# Altium project Nebulizer_medical.PrjPcb
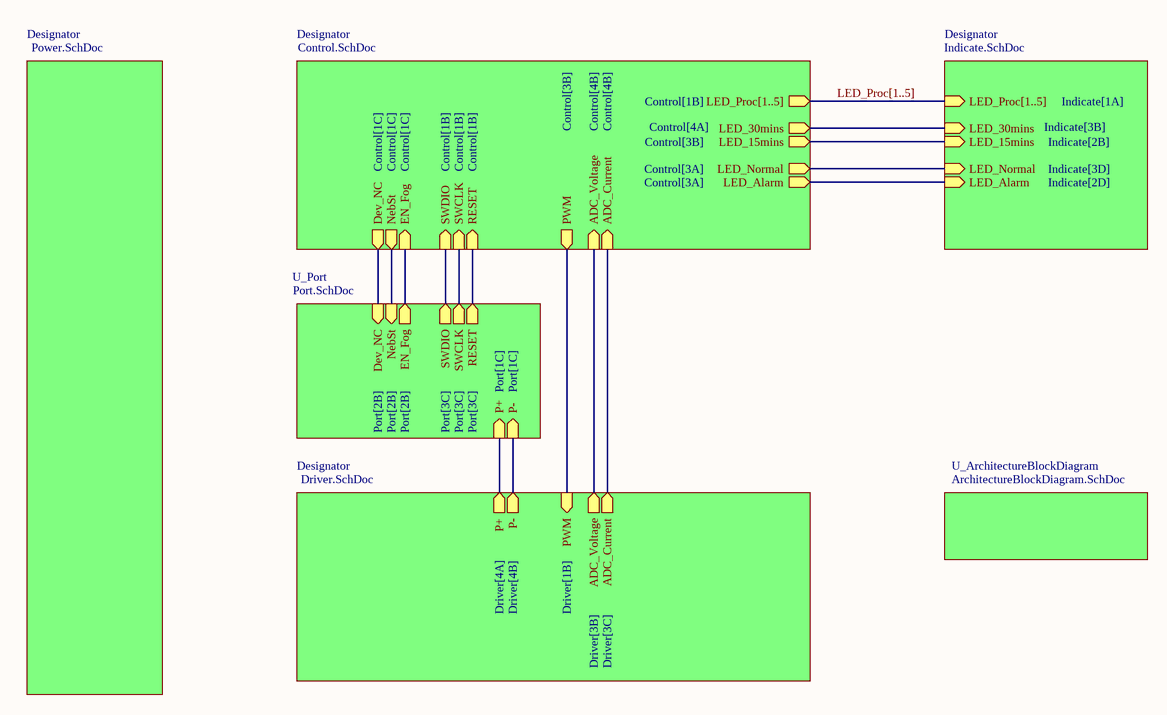
[diagram p0: Top.SchDoc]
7 sheets, 115 parts. Net scope: hierarchical (ports join the sheet entries above them; power ports are global).
Board file: Nebulizer_medical.PcbDoc
Sheets:
  Top.SchDoc
    Designator = Power.SchDoc
    Designator = Control.SchDoc
    Designator = Driver.SchDoc
    Designator = Indicate.SchDoc
    U_ArchitectureBlockDiagram = ArchitectureBlockDiagram.SchDoc
    U_Port = Port.SchDoc

## Sheet Top.SchDoc
size A4; SheetNumber: 1; SheetTotal: 7

### Sub-sheets
Designator = Power.SchDoc: no entries
Designator = Control.SchDoc: LED_30mins (out), LED_Normal (out), LED_15mins (out), PWM (out), ADC_Current (in), ADC_Voltage (in), LED_Alarm (out), Dev_NC (out), NebSt (out), EN_Fog (in), RESET (in), LED_Proc[1..5] (out), SWDIO (in), SWCLK (in)
Designator = Driver.SchDoc: PWM (in), ADC_Current (out), ADC_Voltage (out), P+ (out), P- (out)
Designator = Indicate.SchDoc: LED_Normal (in), LED_30mins (in), LED_15mins (in), LED_Alarm (in), LED_Proc[1..5] (in)
U_ArchitectureBlockDiagram = ArchitectureBlockDiagram.SchDoc: no entries
U_Port = Port.SchDoc: P+ (in), P- (in), Dev_NC (in), NebSt (in), EN_Fog (out), SWCLK (out), SWDIO (out), RESET (out)

### Nets
ADC_Current: sheet Designator/ADC_Current, sheet Designator/ADC_Current
ADC_Voltage: sheet Designator/ADC_Voltage, sheet Designator/ADC_Voltage
Dev_NC: sheet Designator/Dev_NC, sheet U_Port/Dev_NC
EN_Fog: sheet Designator/EN_Fog, sheet U_Port/EN_Fog
NebSt: sheet Designator/NebSt, sheet U_Port/NebSt
PWM: sheet Designator/PWM, sheet Designator/PWM
RESET: sheet Designator/RESET, sheet U_Port/RESET
SWCLK: sheet Designator/SWCLK, sheet U_Port/SWCLK
SWDIO: sheet Designator/SWDIO, sheet U_Port/SWDIO
NetB1_2: sheet Designator/P+, sheet U_Port/P+
NetB2_2: sheet Designator/P-, sheet U_Port/P-
NetLED6_2: sheet Designator/LED_Alarm, sheet Designator/LED_Alarm
NetLED7_2: sheet Designator/LED_Normal, sheet Designator/LED_Normal
NetLED8_2: sheet Designator/LED_15mins, sheet Designator/LED_15mins
NetLED9_2: sheet Designator/LED_30mins, sheet Designator/LED_30mins

### Buses and harness runs
bus LED_Proc[1..5] = sheet Designator/LED_Proc[1..5]

## Sheet Power.SchDoc
size A4; SheetNumber: 2; SheetTotal: 7
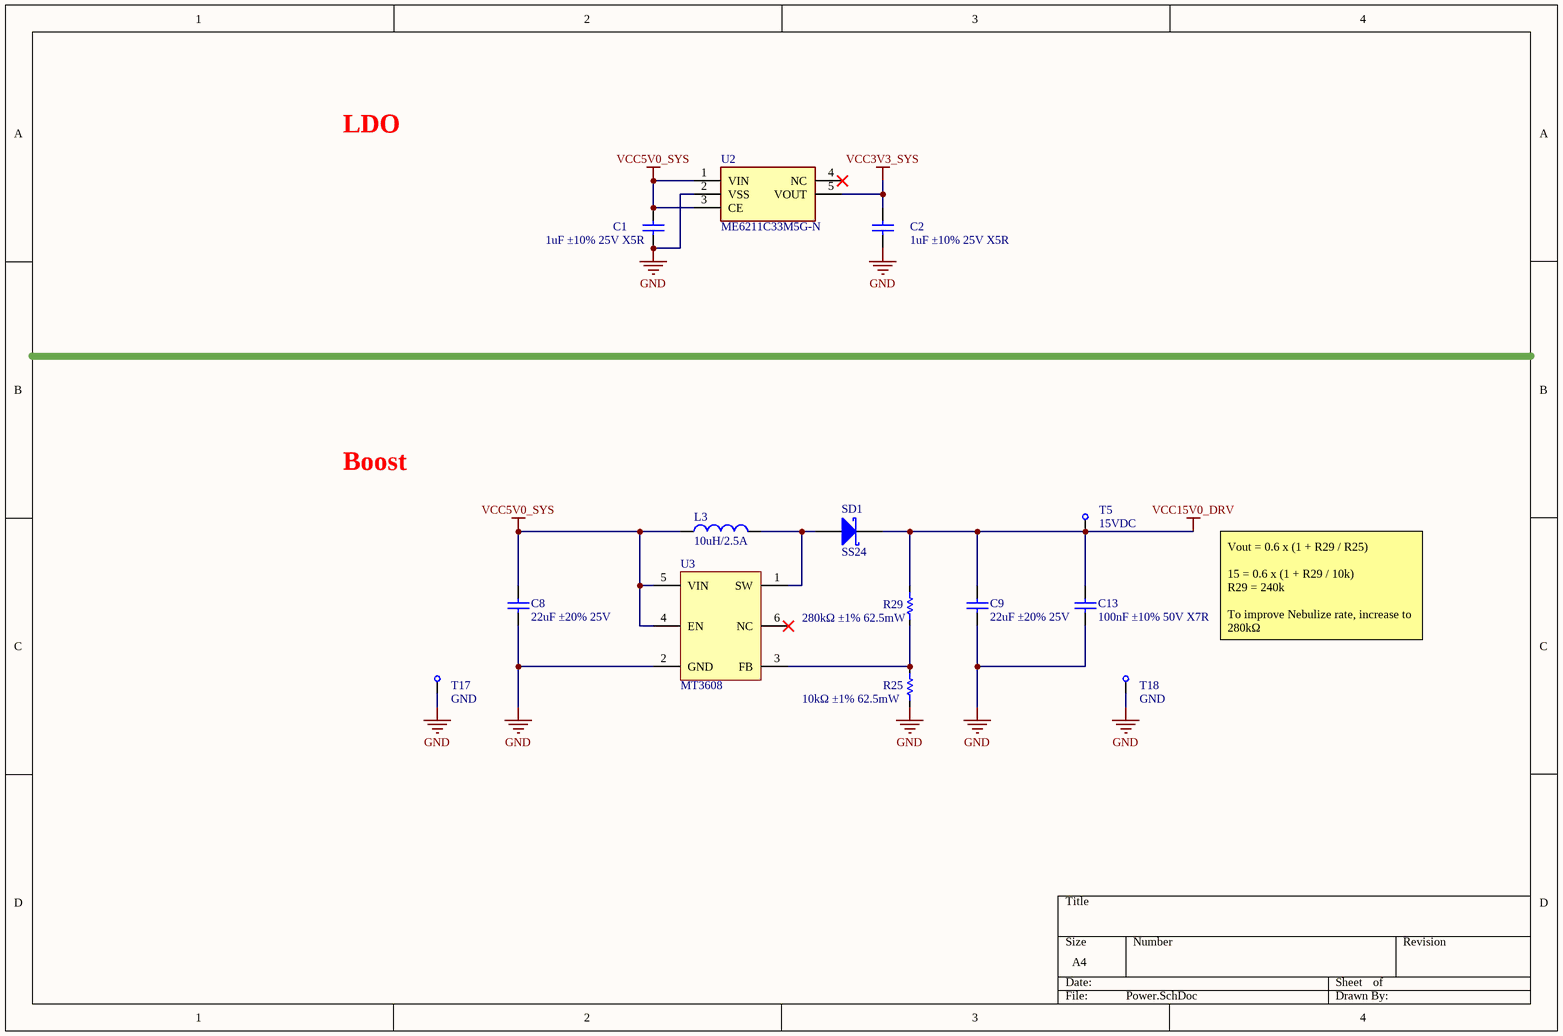
[diagram p1: Power.SchDoc]

### Parts
C1  1uF ±10% 25V X5R  [C0402]
C2  1uF ±10% 25V X5R  [C0402]
C8  22uF ±20% 25V  [C0805]
C9  22uF ±20% 25V  [C0805]
C13  100nF ±10% 50V X7R  [C0402]
L3  10uH/2.5A  [SP0502]
R25  10kΩ ±1% 62.5mW  [R0402]
R29  280kΩ ±1% 62.5mW  [R0402]
SD1  SS24  [SMA-403D]
T5  15VDC  [TP-SIP-1-Small1]
T17  GND  [TP-SIP-1-Small1]
T18  GND  [TP-SIP-1-Small1]
U2  ME6211C33M5G-N  [SOT95P270X145-5N]
U3  MT3608  [SOT95P280X110-6N]

### Nets
GND: C1.1 C2.1 C8.1 C9.1 C13.2 R25.1 T17.1 T18.1 U2.2(VSS) U3.2(GND)
VCC3V3_SYS: C2.2 U2.5(VOUT)
VCC5V0_SYS: C1.2 C8.2 L3.1 U2.1(VIN) U2.3(CE) U3.4(EN) U3.5(VIN)
VCC15V0_DRV: C9.2 C13.1 R29.2 SD1.2(K) T5.1
NetL3_2: L3.2 SD1.1(A) U3.1(SW)
NetR25_2: R25.2 R29.1 U3.3(FB)

Not connected (* = marked no-connect by the designer): U2 4(NC)*; U3 6(NC)*

### Notes on the sheet
- LDO
- Boost
- Vout = 0.6 x (1 + R29 / R25)
  15 = 0.6 x (1 + R29 / 10k)
  R29 = 240k
  To improve Nebulize rate, increase to 280kΩ

### Library data of the parts
C1 C2 = Cap: CL05A475KP5NRNC; Published: 8-Jun-2000; LatestRevisionDate: 17-Jul-2002; LatestRevisionNote: Re-released for DXP Platform.; PackageReference: RAD-0.3; Publisher: Altium Limited; PackageDescription: Radial Cap, Thru-Hole; 2 Leads; 0.3 in Pin Spacing
C8 C9 = C0805: CL21A226MAQNNNE; Published: 8-Jun-2000; LatestRevisionDate: 17-Jul-2002; LatestRevisionNote: Re-released for DXP Platform.; PackageReference: RAD-0.3; Publisher: Altium Limited; PackageDescription: Radial Cap, Thru-Hole; 2 Leads; 0.3 in Pin Spacing
C13 = Cap Semi: CL05B104KB54PNC; Value: 100pF; Published: 8-Jun-2000; LatestRevisionDate: 29-May-2009; LatestRevisionNote: IPC-7351 Footprint Added.; PackageReference: C1206; Publisher: Altium Limited; PackageDescription: Chip Capacitor
L3 = Inductor: SWPA6028S100MT; Code_IEC: 1005; Value: 10uH; Published: 8-Jun-2000; LatestRevisionDate: 29-May-2009; LatestRevisionNote: IPC-7351 Footprint Added.; PackageReference: 0402-A; Publisher: Altium Limited; PackageDescription: Chip Inductor; Code_JEITA: 0402
R25 = R0402: 0402WGF1002TCE; Published: 8-Jun-2000; LatestRevisionDate: 17-Jul-2002; LatestRevisionNote: Re-released for DXP Platform.; PackageReference: AXIAL-0.3; Publisher: Altium Limited; PackageDescription: Axial Device, Thru-Hole; 2 Leads; 0.3 in Pin Spacing
R29 = R0402: 0402WGF2803TCE; Published: 8-Jun-2000; LatestRevisionDate: 17-Jul-2002; LatestRevisionNote: Re-released for DXP Platform.; PackageReference: AXIAL-0.3; Publisher: Altium Limited; PackageDescription: Axial Device, Thru-Hole; 2 Leads; 0.3 in Pin Spacing
SD1 = D Schottky: C50645; Published: 8-Jun-2000; LatestRevisionDate: 17-Jul-2002; LatestRevisionNote: Re-released for DXP Platform.; PackageReference: SMB; Publisher: Altium Limited; PackageDescription: DO-214-AA/SMB; 2 C-Bend Leads; Body 5.3 x 3.6 mm, inc. leads (LxW); Code_JEDEC: DO-214-AA
T5 T17 T18 = TP-SIP-1-Small
U2 = ME6211C33M5G-N: ME6211C33M5G-N / LDO 3.3V; Manufacturer_Name: Microne; Datasheet Link: https://datasheet.lcsc.com/szlcsc/1811131510_MICRONE-Nanjing-Micro-One-Elec-ME6211C33M5G-N_C82942.pdf; Height: 1.45mm; Manufacturer_Part_Number: ME6211C33M5G-N

## Sheet Control.SchDoc
size A3; SheetNumber: 4; SheetTotal: 7
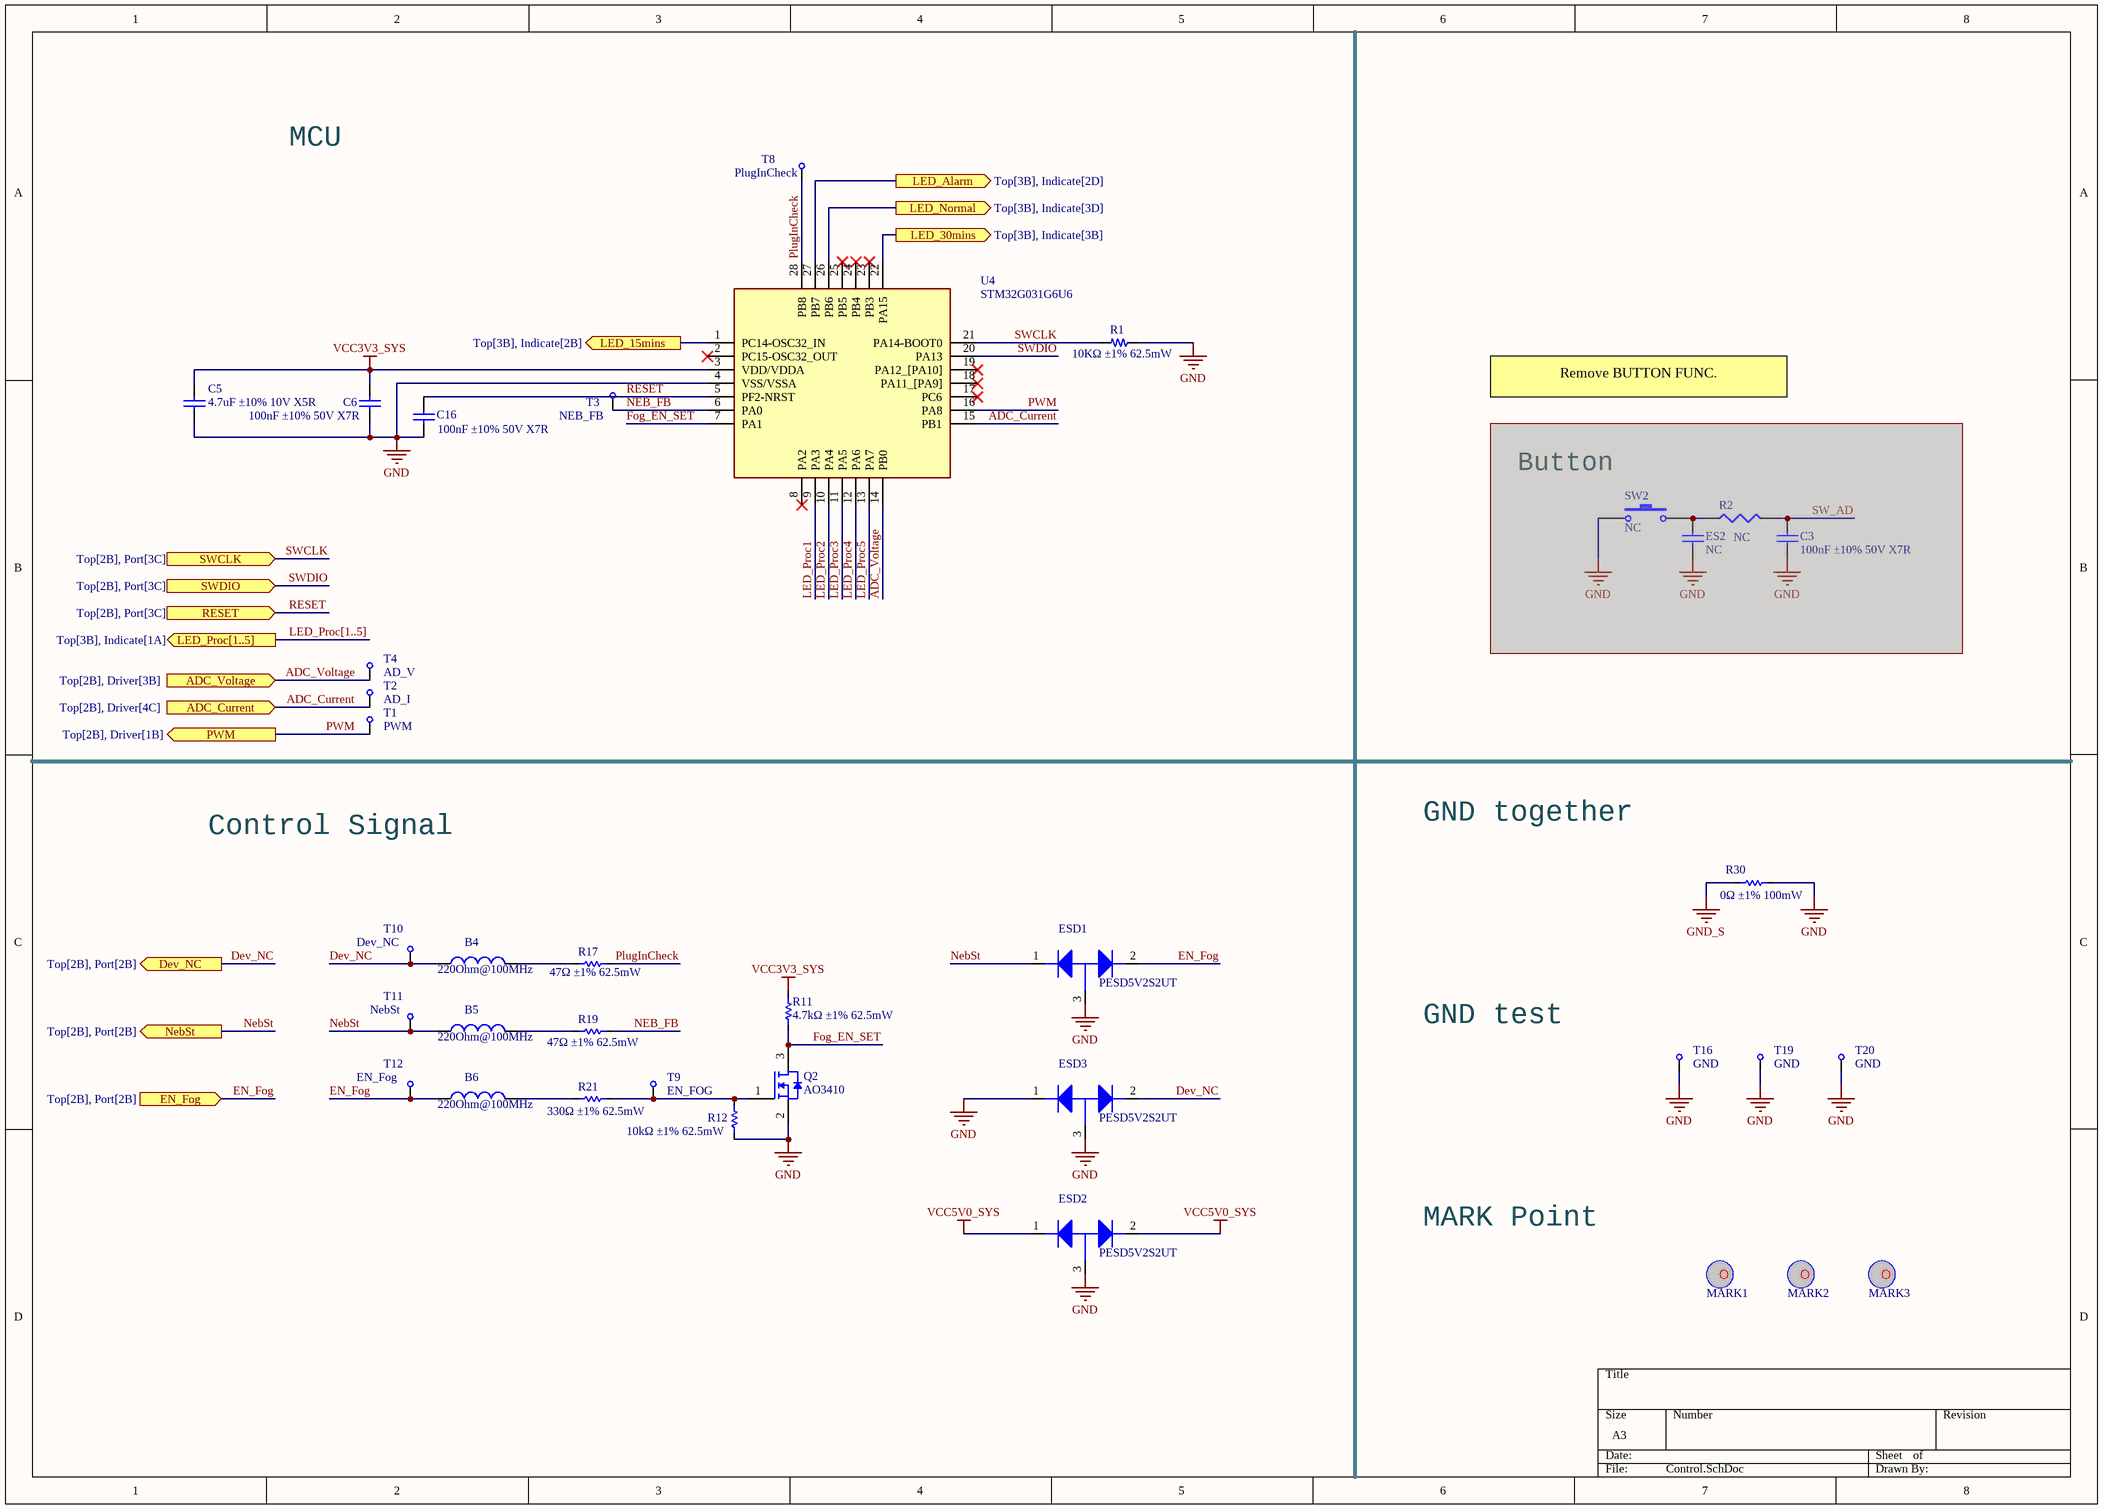
[diagram p2: Control.SchDoc]

### Parts
B4  220Ohm@100MHz  [0402-B]
B5  220Ohm@100MHz  [0402-B]
B6  220Ohm@100MHz  [0402-B]
C3  100nF ±10% 50V X7R  [C0402]  (masked out: inside a compile mask, not in the netlist)
C5  4.7uF ±10% 10V X5R  [C0402]
C6  100nF ±10% 50V X7R  [C0402]
C16  100nF ±10% 50V X7R  [C0402]
ES2  NC  [C0402]  (masked out: inside a compile mask, not in the netlist)
ESD1  PESD5V2S2UT  [SOT23]
ESD2  PESD5V2S2UT  [SOT23]
ESD3  PESD5V2S2UT  [SOT23]
MARK1  MARK_POINT  [MARK_POINT]  (value not drawn)
MARK2  MARK_POINT  [MARK_POINT]  (value not drawn)
MARK3  MARK_POINT  [MARK_POINT]  (value not drawn)
Q2  AO3410  [SOT23-3]
R1  10KΩ ±1% 62.5mW  [R0402]
R2  NC  [R0402]  (masked out: inside a compile mask, not in the netlist)
R11  4.7kΩ ±1% 62.5mW  [R0402]
R12  10kΩ ±1% 62.5mW  [R0402]
R17  47Ω ±1% 62.5mW  [R0402]
R19  47Ω ±1% 62.5mW  [R0402]
R21  330Ω ±1% 62.5mW  [R0402]
R30  0Ω ±1% 100mW  [R0603]
SW2  NC  [HTS-52MB]  (masked out: inside a compile mask, not in the netlist)
T1  PWM  [TP-SIP-1-Small1]
T2  AD_I  [TP-SIP-1-Small1]
T3  NEB_FB  [TP-SIP-1-Small1]
T4  AD_V  [TP-SIP-1-Small1]
T8  PlugInCheck  [TP-SIP-1-Small1]
T9  EN_FOG  [TP-SIP-1-Small1]
T10  Dev_NC  [TP-SIP-1-Small1]
T11  NebSt  [TP-SIP-1-Small1]
T12  EN_Fog  [TP-SIP-1-Small1]
T16  GND  [TP-SIP-1-Small1]
T19  GND  [TP-SIP-1-Small1]
T20  GND  [TP-SIP-1-Small1]
U4  STM32G031G6U6  [QFN50P400X400X60-28N-D]

### Ports
ADC_Current (in, see Top[2B], Driver[4C]), ADC_Voltage (in, see Top[2B], Driver[3B]), Dev_NC (out, see Top[2B], Port[2B]), EN_Fog (in, see Top[2B], Port[2B]), LED_15mins (out, see Top[3B], Indicate[2B]), LED_30mins (out, see Top[3B], Indicate[3B]), LED_Alarm (out, see Top[3B], Indicate[2D]), LED_Normal (out, see Top[3B], Indicate[3D]), LED_Proc[1..5] (out, see Top[3B], Indicate[1A]), NebSt (out, see Top[2B], Port[2B]), PWM (out, see Top[2B], Driver[1B]), RESET (in, see Top[2B], Port[3C]), SWCLK (in, see Top[2B], Port[3C]), SWDIO (in, see Top[2B], Port[3C])

### Nets
GND: C5.1 C6.1 C16.1 ESD1.3(G) ESD2.3(G) ESD3.1(S) ESD3.3(G) Q2.2(S) R1.1 R12.1 R30.2 T16.1 T19.1 T20.1 U4.4(VSS/VSSA)
GND_S: R30.1
VCC3V3_SYS: C5.2 C6.2 R11.2 U4.3(VDD/VDDA)
VCC5V0_SYS: ESD2.1(S) ESD2.2(S)
ADC_Current: T2.1 U4.15(PB1) ; port ADC_Current
ADC_Voltage: T4.1 U4.14(PB0) ; port ADC_Voltage
Dev_NC: B4.1 ESD3.2(S) T10.1 ; port Dev_NC
EN_Fog: B6.1 ESD1.2(S) T12.1 ; port EN_Fog
Fog_EN_SET: Q2.3(D) R11.1 U4.7(PA1)
LED_Proc1: U4.9(PA3)
LED_Proc2: U4.10(PA4)
LED_Proc3: U4.11(PA5)
LED_Proc4: U4.12(PA6)
LED_Proc5: U4.13(PA7)
NEB_FB: R19.2 T3.1 U4.6(PA0)
NebSt: B5.1 ESD1.1(S) T11.1 ; port NebSt
PlugInCheck: R17.2 T8.1 U4.28(PB8)
PWM: T1.1 U4.16(PA8) ; port PWM
RESET: C16.2 U4.5(PF2-NRST) ; port RESET
SWCLK: R1.2 U4.21(PA14-BOOT0) ; port SWCLK
SWDIO: U4.20(PA13) ; port SWDIO
NetB4_2: B4.2 R17.1
NetB5_2: B5.2 R19.1
NetB6_2: B6.2 R21.1
NetLED6_2: U4.27(PB7) ; port LED_Alarm
NetLED7_2: U4.26(PB6) ; port LED_Normal
NetLED8_2: U4.1(PC14-OSC32_IN) ; port LED_15mins
NetLED9_2: U4.22(PA15) ; port LED_30mins
NetQ2_1: Q2.1(G) R12.2 R21.2 T9.1

Not connected (* = marked no-connect by the designer): U4 2(PC15-OSC32_OUT)* 8(PA2)* 17(PC6)* 18(PA11_[PA9])* 19(PA12_[PA10])* 23(PB3)* 24(PB4)* 25(PB5)*

### Buses and harness runs
bus LED_Proc[1..5] = port LED_Proc[1..5]

### Notes on the sheet
- MCU
- Remove BUTTON FUNC.
- (near SW2) Button
- Control Signal
- GND together
- GND test
- MARK Point

### Library data of the parts
B4-B6 = Inductor: BLM15AG221SN1D; Code_IEC: 1005; Value: 10uH; Published: 8-Jun-2000; LatestRevisionDate: 29-May-2009; LatestRevisionNote: IPC-7351 Footprint Added.; PackageReference: 0402-A; Publisher: Altium Limited; PackageDescription: Chip Inductor; Code_JEITA: 0402
C3 ES2 = Cap Semi: Capacitor (Semiconductor SIM Model); Value: 100pF; Published: 8-Jun-2000; LatestRevisionDate: 29-May-2009; LatestRevisionNote: IPC-7351 Footprint Added.; PackageReference: C1206; Publisher: Altium Limited; PackageDescription: Chip Capacitor
C5 = Cap: CL05A475KP5NRNC; Published: 8-Jun-2000; LatestRevisionDate: 17-Jul-2002; LatestRevisionNote: Re-released for DXP Platform.; PackageReference: RAD-0.3; Publisher: Altium Limited; PackageDescription: Radial Cap, Thru-Hole; 2 Leads; 0.3 in Pin Spacing
C6 C16 = Cap: CL05B104KO5NNNC; Published: 8-Jun-2000; LatestRevisionDate: 17-Jul-2002; LatestRevisionNote: Re-released for DXP Platform.; PackageReference: RAD-0.3; Publisher: Altium Limited; PackageDescription: Radial Cap, Thru-Hole; 2 Leads; 0.3 in Pin Spacing
ESD1-ESD3 = ESD
Q2 = AO3410: AOS,AO3410,SOT23-3,-55~+150°C,; 名称: N-MOS AO3410; 制造商: AOS; 详细信息: AOS,AO3410,SOT23-3,-55~+150°C,
R1 = R-0603: 0402WGF1002TCE
R2 = Res3: Resistor; Value: 4.7K; Published: 8-Jun-2000; LatestRevisionDate: 29-May-2009; LatestRevisionNote: IPC-7351 Footprint Added.; PackageReference: J1-0603; Publisher: Altium Limited; PackageDescription: Chip Resistor
R11 = R0402: 0402WGF4701TCE; Published: 8-Jun-2000; LatestRevisionDate: 17-Jul-2002; LatestRevisionNote: Re-released for DXP Platform.; PackageReference: AXIAL-0.3; Publisher: Altium Limited; PackageDescription: Axial Device, Thru-Hole; 2 Leads; 0.3 in Pin Spacing
R12 = R0402: 0402WGF1002TCE; Published: 8-Jun-2000; LatestRevisionDate: 17-Jul-2002; LatestRevisionNote: Re-released for DXP Platform.; PackageReference: AXIAL-0.3; Publisher: Altium Limited; PackageDescription: Axial Device, Thru-Hole; 2 Leads; 0.3 in Pin Spacing
R17 R19 = R0402: RC0402FR-0747RL; Published: 8-Jun-2000; LatestRevisionDate: 17-Jul-2002; LatestRevisionNote: Re-released for DXP Platform.; PackageReference: AXIAL-0.3; Publisher: Altium Limited; PackageDescription: Axial Device, Thru-Hole; 2 Leads; 0.3 in Pin Spacing
R21 = R0402: 0402WGF3300TCE; Published: 8-Jun-2000; LatestRevisionDate: 17-Jul-2002; LatestRevisionNote: Re-released for DXP Platform.; PackageReference: AXIAL-0.3; Publisher: Altium Limited; PackageDescription: Axial Device, Thru-Hole; 2 Leads; 0.3 in Pin Spacing
R30 = R0603: 0603WAF0000T5E; Published: 8-Jun-2000; LatestRevisionDate: 17-Jul-2002; LatestRevisionNote: Re-released for DXP Platform.; PackageReference: AXIAL-0.3; Publisher: Altium Limited; PackageDescription: Axial Device, Thru-Hole; 2 Leads; 0.3 in Pin Spacing
SW2 = SW-PB: Switch; Published: 24-Mar-1999; LatestRevisionDate: 17-Jul-2002; LatestRevisionNote: Re-released for DXP Platform.; PackageReference: SPST-2; Publisher: Altium Limited; PackageDescription: Switch; 2 Leads
T1-T4 T8-T12 T16 T19 T20 = TP-SIP-1-Small
U4 = STM32G031G6U6: Manufacturer_Name: STMicroelectronics; Datasheet Link: https://www.st.com/resource/en/datasheet/stm32g031c6.pdf; Height: 0.6mm; Manufacturer_Part_Number: STM32G031G6U6; Mouser Part Number: 511-STM32G031G6U6; Mouser Price/Stock: https://www.mouser.co.uk/ProductDetail/STMicroelectronics/STM32G031G6U6?qs=uwxL4vQweFPW1MMtF4vVDQ%3D%3D; Arrow Part Number: STM32G031G6U6; Arrow Price/Stock: https://www.arrow.com/en/products/stm32g031g6u6/stmicroelectronics?region=nac

## Sheet Driver.SchDoc
size A4; SheetNumber: 6; SheetTotal: 7
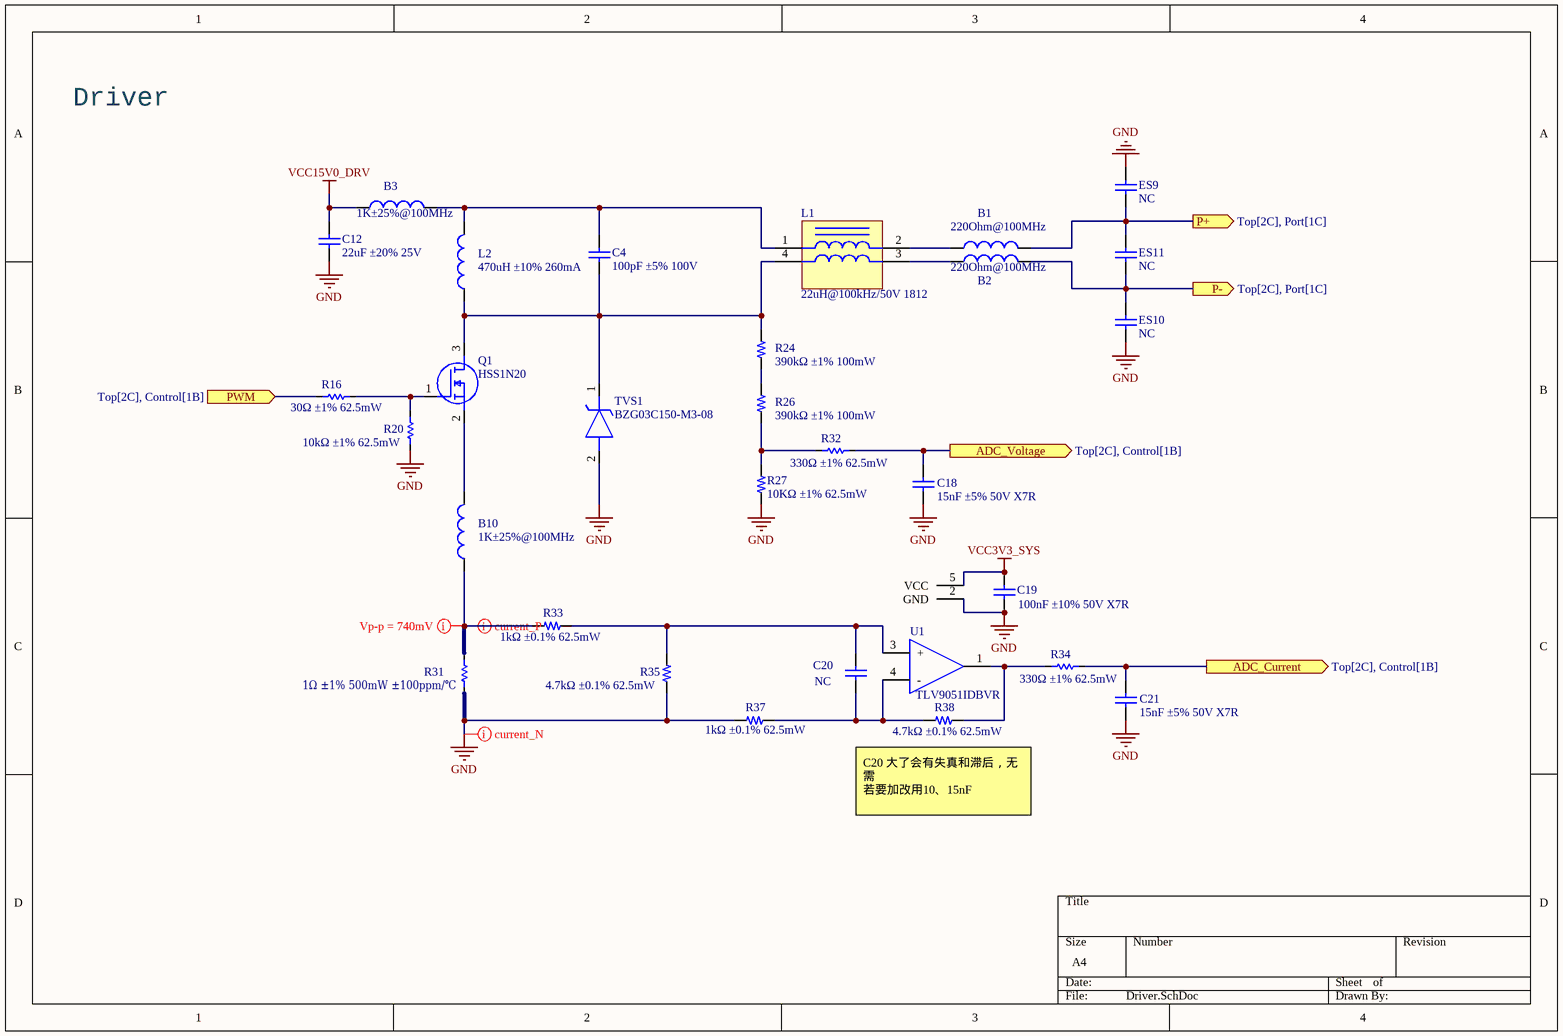
[diagram p3: Driver.SchDoc]

### Parts
B1  220Ohm@100MHz  [0402-B]
B2  220Ohm@100MHz  [0402-B]
B3  1K±25%@100MHz  [0805-B]
B10  1K±25%@100MHz  [0805-B]
C4  100pF ±5% 100V  [C0603]
C12  22uF ±20% 25V  [C0805]
C18  15nF ±5% 50V X7R  [C0402]
C19  100nF ±10% 50V X7R  [C0402]
C20  NC  [C0402]
C21  15nF ±5% 50V X7R  [C0402]
ES9  NC  [C0402]
ES10  NC  [C0402]
ES11  NC  [C0402]
L1  22uH@100kHz/50V 1812  [LINEFILTER]
L2  470uH ±10% 260mA  [SP0502]
Q1  HSS1N20  [SOT95P237X122-3N]
R16  30Ω ±1% 62.5mW  [R0402]
R20  10kΩ ±1% 62.5mW  [R0402]
R24  390kΩ ±1% 100mW  [R0603]
R26  390kΩ ±1% 100mW  [R0603]
R27  10KΩ ±1% 62.5mW  [R0402]
R31  1Ω ±1% 500mW ±100ppm/℃  [R1206]
R32  330Ω ±1% 62.5mW  [R0402]
R33  1kΩ ±0.1% 62.5mW  [R0402]
R34  330Ω ±1% 62.5mW  [R0402]
R35  4.7kΩ ±0.1% 62.5mW  [R0402]
R37  1kΩ ±0.1% 62.5mW  [R0402]
R38  4.7kΩ ±0.1% 62.5mW  [R0402]
TVS1  BZG03C150-M3-08  [DIOM5226X230N]
U1  TLV9051IDBVR  [SOT23-5]

### Ports
ADC_Current (out, see Top[2C], Control[1B]), ADC_Voltage (out, see Top[2C], Control[1B]), P+ (out, see Top[2C], Port[1C]), P- (out, see Top[2C], Port[1C]), PWM (in, see Top[2C], Control[1B])

### Nets
GND: C12.1 C18.2 C19.1 C21.2 ES9.1 ES10.2 R20.1 R27.2 R31.1 R35.1 R37.1 TVS1.2(A) U1.2(GND)
VCC3V3_SYS: C19.2 U1.5(VCC)
VCC15V0_DRV: B3.1 C12.2
ADC_Current: C21.1 R34.2 ; port ADC_Current
ADC_Voltage: C18.1 R32.2 ; port ADC_Voltage
PWM: R16.1 ; port PWM
NetB1_1: B1.1 L1.2
NetB1_2: B1.2 ES9.2 ES11.1 ; port P+
NetB2_1: B2.1 L1.3
NetB2_2: B2.2 ES10.1 ES11.2 ; port P-
NetB3_2: B3.2 C4.1 L1.1 L2.2
NetB10_1: B10.1 R31.2 R33.1
NetB10_2: B10.2 Q1.2(S)
NetC4_2: C4.2 L1.4 L2.1 Q1.3(D) R24.1 TVS1.1(K)
NetC20_1: C20.1 R37.2 R38.2 U1.4(-)
NetC20_2: C20.2 R33.2 R35.2 U1.3(+)
NetQ1_1: Q1.1(G) R16.2 R20.2
NetR24_2: R24.2 R26.1
NetR26_2: R26.2 R27.1 R32.1
NetR34_1: R34.1 R38.1 U1.1

### Layout directives
mark named Vp-p = 740mV: NetB10_1
differential pair: GND, NetB10_1

### Notes on the sheet
- Driver
- Power NMOS
  Alternative:
  HSS1N20
  G01N20LE
  G2003A
- (near R38) 差分放大电路
  化简为:
  Vout = (R2 / R1) (Vr - Vgnd)
- (near R38) C20 大了会有失真和滞后，无需
  若要加改用10、15nF

### Library data of the parts
B1 B2 = Inductor: as B4 on sheet Control; Published: 8-Jun-2000; LatestRevisionDate: 29-May-2009; LatestRevisionNote: IPC-7351 Footprint Added.; PackageReference: 0402-A; Publisher: Altium Limited; PackageDescription: Chip Inductor; Code_JEITA: 0402
B3 B10 = Inductor: BLM21AG102SN1D; Code_IEC: 1005; Value: 10uH; Published: 8-Jun-2000; LatestRevisionDate: 29-May-2009; LatestRevisionNote: IPC-7351 Footprint Added.; PackageReference: 0402-A; Publisher: Altium Limited; PackageDescription: Chip Inductor; Code_JEITA: 0402
C4 = Cap Semi: GCM1885C2A101JA16D; Published: 8-Jun-2000; LatestRevisionDate: 29-May-2009; LatestRevisionNote: IPC-7351 Footprint Added.; PackageReference: C1206; Publisher: Altium Limited; PackageDescription: Chip Capacitor; Value: 100pF
C12 = C0805: CL21A226MAQNNNE; Published: 8-Jun-2000; LatestRevisionDate: 17-Jul-2002; LatestRevisionNote: Re-released for DXP Platform.; PackageReference: RAD-0.3; Publisher: Altium Limited; PackageDescription: Radial Cap, Thru-Hole; 2 Leads; 0.3 in Pin Spacing
C18 C21 = Cap: CC0402KRX7R9BB153; Published: 8-Jun-2000; LatestRevisionDate: 17-Jul-2002; LatestRevisionNote: Re-released for DXP Platform.; PackageReference: RAD-0.3; Publisher: Altium Limited; PackageDescription: Radial Cap, Thru-Hole; 2 Leads; 0.3 in Pin Spacing
C19 = Cap: CL05B104KO5NNNC; Published: 8-Jun-2000; LatestRevisionDate: 17-Jul-2002; LatestRevisionNote: Re-released for DXP Platform.; PackageReference: RAD-0.3; Publisher: Altium Limited; PackageDescription: Radial Cap, Thru-Hole; 2 Leads; 0.3 in Pin Spacing
C20 = 100nF_1: 10nF 50V 0402; 物料编号: 210001894; 详细描述: X7R,50V,三星CL21B104JBCNNNC; 版本: V1.00; 名称: 贴片瓷介电容100nF±5%,0805; 制造商: 三星
ES9-ES11 = Cap Semi: as C3 on sheet Control; Published: 8-Jun-2000; LatestRevisionDate: 29-May-2009; LatestRevisionNote: IPC-7351 Footprint Added.; PackageReference: C1206; Publisher: Altium Limited; PackageDescription: Chip Capacitor
L1 = Inductor_common: APWB4532-220T2
L2 = Inductor: SDR0603-471KL; Code_IEC: 1005; Value: 10uH; Published: 8-Jun-2000; LatestRevisionDate: 29-May-2009; LatestRevisionNote: IPC-7351 Footprint Added.; PackageReference: 0402-A; Publisher: Altium Limited; PackageDescription: Chip Inductor; Code_JEITA: 0402
Q1 = FDN86246: MOSFET (N-Channel); Manufacturer_Name: onsemi; Datasheet Link: https://www.onsemi.com/pub/Collateral/FDN86246-D.pdf; Height: 1.22mm; Manufacturer_Part_Number: FDN86246; Mouser Part Number: 512-FDN86246; Mouser Price/Stock: https://www.mouser.co.uk/ProductDetail/onsemi-Fairchild/FDN86246?qs=dIxESgyDOrhoaLoGKHFSzg%3D%3D; Arrow Part Number: FDN86246; Arrow Price/Stock: https://www.arrow.com/en/products/fdn86246/on-semiconductor?region=nac
R16 = R0402: RC0402FR-0730RL; Published: 8-Jun-2000; LatestRevisionDate: 17-Jul-2002; LatestRevisionNote: Re-released for DXP Platform.; PackageReference: AXIAL-0.3; Publisher: Altium Limited; PackageDescription: Axial Device, Thru-Hole; 2 Leads; 0.3 in Pin Spacing
R20 = R0402: 0402WGF1002TCE; Published: 8-Jun-2000; LatestRevisionDate: 17-Jul-2002; LatestRevisionNote: Re-released for DXP Platform.; PackageReference: AXIAL-0.3; Publisher: Altium Limited; PackageDescription: Axial Device, Thru-Hole; 2 Leads; 0.3 in Pin Spacing
R24 R26 = R-0603: RC0603FR-07390KL
R27 = R-0603: 0402WGF1002TCE
R31 = R1206: HP06W2F100KT5E; Published: 8-Jun-2000; LatestRevisionDate: 17-Jul-2002; LatestRevisionNote: Re-released for DXP Platform.; PackageReference: AXIAL-0.3; Publisher: Altium Limited; PackageDescription: Axial Device, Thru-Hole; 2 Leads; 0.3 in Pin Spacing
R32 R34 = R0402: 0402WGF3300TCE; Published: 8-Jun-2000; LatestRevisionDate: 17-Jul-2002; LatestRevisionNote: Re-released for DXP Platform.; PackageReference: AXIAL-0.3; Publisher: Altium Limited; PackageDescription: Axial Device, Thru-Hole; 2 Leads; 0.3 in Pin Spacing
R33 R37 = R-0603: RT0402BRD071KL
R35 R38 = R-0603: RT0402BRD074K7L
TVS1 = BZG03C150-M3-08: Zener Diode / BZG03C150-M3-08; Manufacturer_Name: Vishay; Datasheet Link: http://www.vishay.com/docs/86138/bzg03c-m-series.pdf; Height: 2.3mm; Manufacturer_Part_Number: BZG03C150-M3-08; Mouser Part Number: 78-BZG03C150-M3-08; Mouser Price/Stock: https://www.mouser.co.uk/ProductDetail/Vishay-Semiconductors/BZG03C150-M3-08?qs=j%252B1pi9TdxUabEYlfZgnvtQ%3D%3D; Arrow Part Number: BZG03C150-M3-08; Arrow Price/Stock: https://www.arrow.com/en/products/bzg03c150-m3-08/vishay
U1 = TLV333IDBVR: TLV9051 适用于成本优化型应用的单路、5.5V、5MHz、15V/μs 压摆率、RRIO 运算放大器

## Sheet Indicate.SchDoc
size A4; SheetNumber: 5; SheetTotal: 7
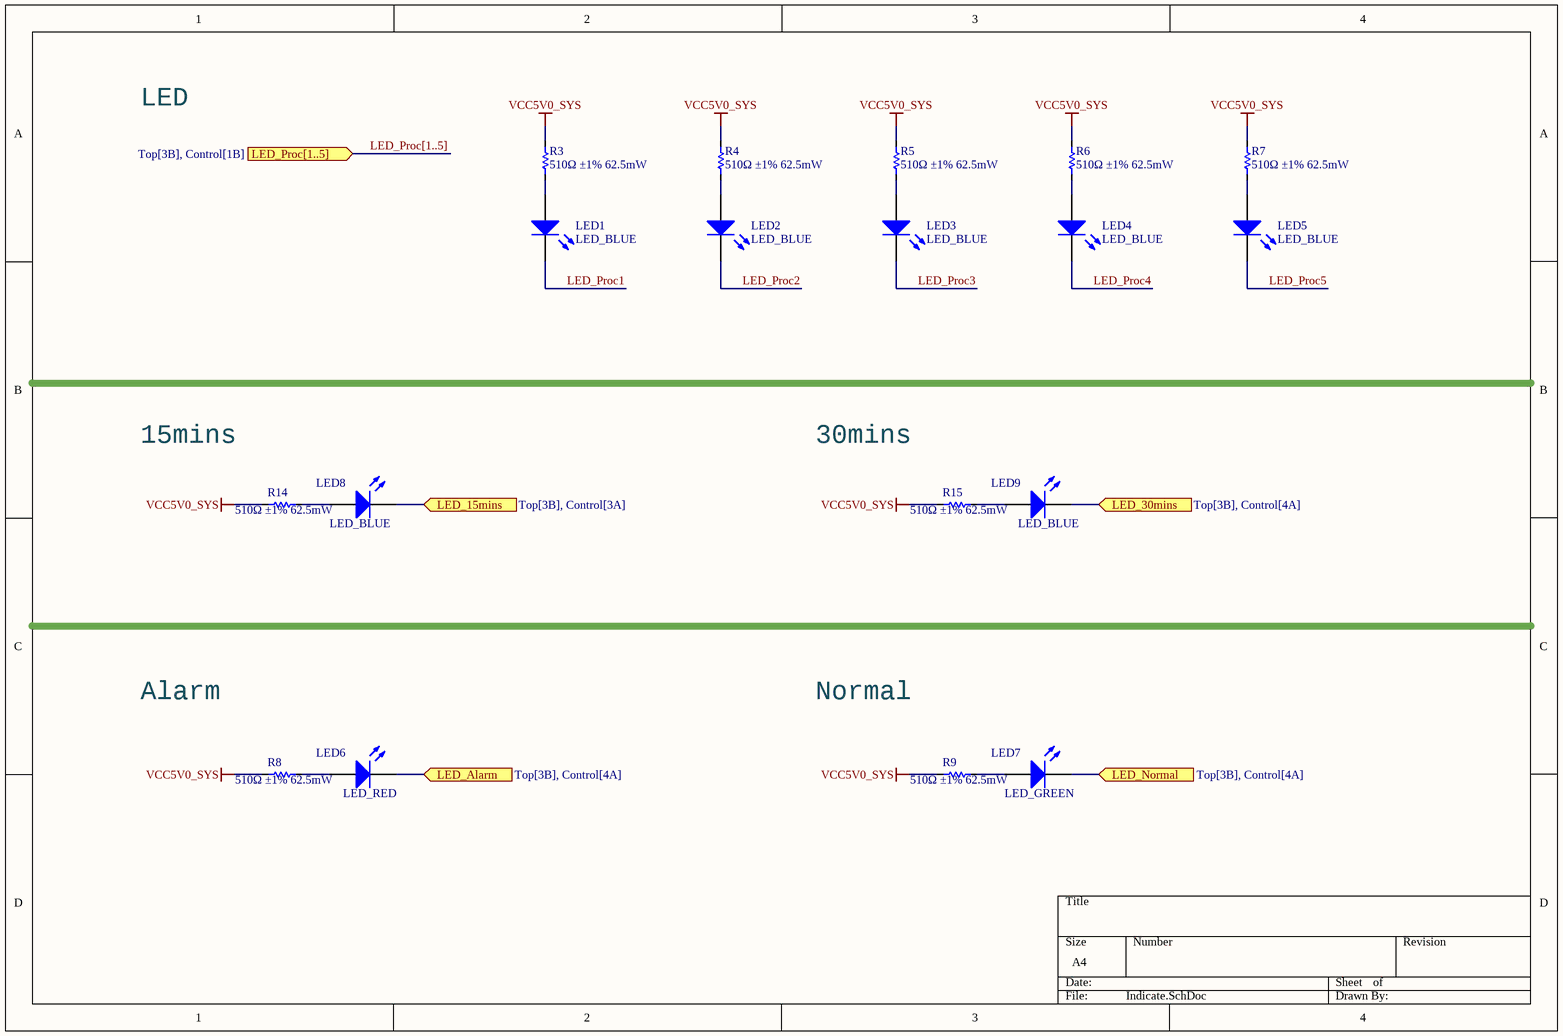
[diagram p4: Indicate.SchDoc]

### Parts
LED1  LED_BLUE  [LED0603]
LED2  LED_BLUE  [LED0603]
LED3  LED_BLUE  [LED0603]
LED4  LED_BLUE  [LED0603]
LED5  LED_BLUE  [LED0603]
LED6  LED_RED  [LED0603]
LED7  LED_GREEN  [LED0603]
LED8  LED_BLUE  [LED0603]
LED9  LED_BLUE  [LED0603]
R3  510Ω ±1% 62.5mW  [R0402]
R4  510Ω ±1% 62.5mW  [R0402]
R5  510Ω ±1% 62.5mW  [R0402]
R6  510Ω ±1% 62.5mW  [R0402]
R7  510Ω ±1% 62.5mW  [R0402]
R8  510Ω ±1% 62.5mW  [R0402]
R9  510Ω ±1% 62.5mW  [R0402]
R14  510Ω ±1% 62.5mW  [R0402]
R15  510Ω ±1% 62.5mW  [R0402]

### Ports
LED_15mins (in, see Top[3B], Control[3A]), LED_30mins (in, see Top[3B], Control[4A]), LED_Alarm (in, see Top[3B], Control[4A]), LED_Normal (in, see Top[3B], Control[4A]), LED_Proc[1..5] (in, see Top[3B], Control[1B])

### Nets
VCC5V0_SYS: R3.2 R4.2 R5.2 R6.2 R7.2 R8.1 R9.1 R14.1 R15.1
LED_Proc1: LED1.2(K)
LED_Proc2: LED2.2(K)
LED_Proc3: LED3.2(K)
LED_Proc4: LED4.2(K)
LED_Proc5: LED5.2(K)
NetLED1_1: LED1.1(A) R3.1
NetLED2_1: LED2.1(A) R4.1
NetLED3_1: LED3.1(A) R5.1
NetLED4_1: LED4.1(A) R6.1
NetLED5_1: LED5.1(A) R7.1
NetLED6_1: LED6.1(A) R8.2
NetLED6_2: LED6.2(K) ; port LED_Alarm
NetLED7_1: LED7.1(A) R9.2
NetLED7_2: LED7.2(K) ; port LED_Normal
NetLED8_1: LED8.1(A) R14.2
NetLED8_2: LED8.2(K) ; port LED_15mins
NetLED9_1: LED9.1(A) R15.2
NetLED9_2: LED9.2(K) ; port LED_30mins

### Buses and harness runs
bus LED_Proc[1..5] = port LED_Proc[1..5]

### Notes on the sheet
- LED
- 15mins
- 30mins
- Alarm
- Normal

### Library data of the parts
LED1-LED5 LED8 LED9 = LED2: XL-1608UBC-04; Published: 8-Jun-2000; LatestRevisionDate: 17-Jul-2002; LatestRevisionNote: Re-released for DXP Platform.; PackageVersion: Feb-2002; PackageReference: 3.2X1.6X1.1; Publisher: Altium Limited; PackageDescription: SM LED; 2 Flat Leads
LED6 = LED2: XL-1608SURC-06; Published: 8-Jun-2000; LatestRevisionDate: 17-Jul-2002; LatestRevisionNote: Re-released for DXP Platform.; PackageVersion: Feb-2002; PackageReference: 3.2X1.6X1.1; Publisher: Altium Limited; PackageDescription: SM LED; 2 Flat Leads
LED7 = LED2: XL-1608PGC-06; Published: 8-Jun-2000; LatestRevisionDate: 17-Jul-2002; LatestRevisionNote: Re-released for DXP Platform.; PackageVersion: Feb-2002; PackageReference: 3.2X1.6X1.1; Publisher: Altium Limited; PackageDescription: SM LED; 2 Flat Leads
R3-R9 R14 R15 = R0402: 0402WGF5100TCE; Published: 8-Jun-2000; LatestRevisionDate: 17-Jul-2002; LatestRevisionNote: Re-released for DXP Platform.; PackageReference: AXIAL-0.3; Publisher: Altium Limited; PackageDescription: Axial Device, Thru-Hole; 2 Leads; 0.3 in Pin Spacing

## Sheet ArchitectureBlockDiagram.SchDoc
size A4; SheetNumber: 6; SheetTotal: 6
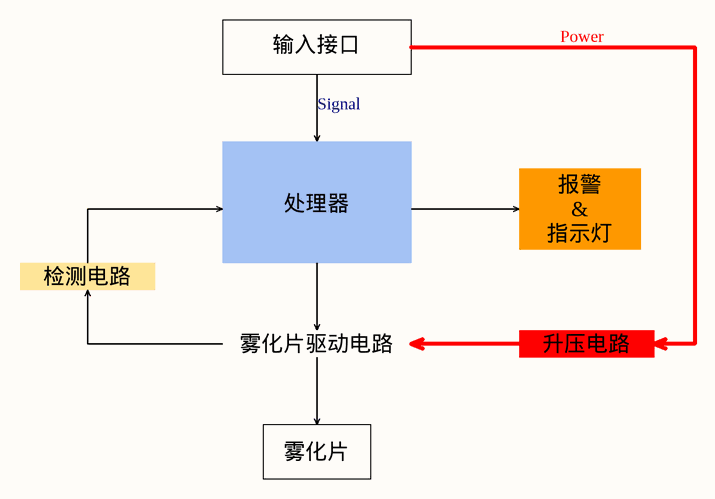
[diagram p5: ArchitectureBlockDiagram.SchDoc]

### Notes on the sheet
- 输入接口
- Power
- Signal
- 检测电路
- 处理器
- 报警
  &
  指示灯
- 雾化片驱动电路
- 升压电路
- 雾化片

## Sheet Port.SchDoc
size A4; SheetNumber: 3; SheetTotal: 7
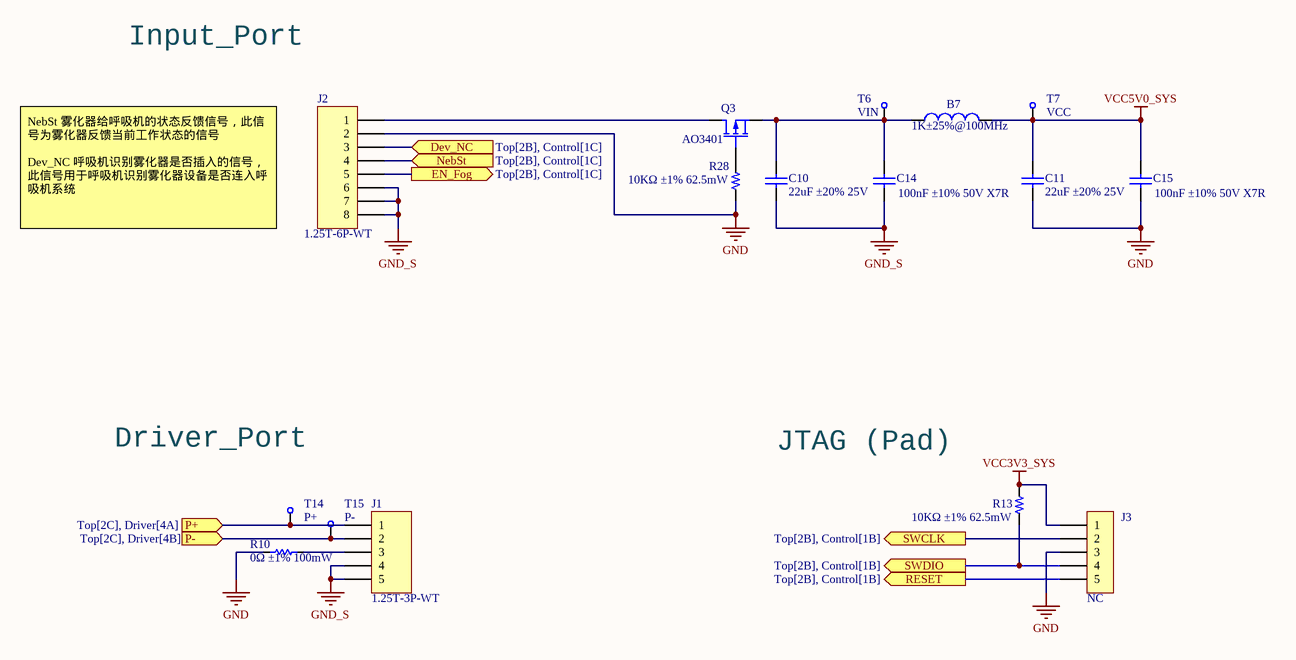
[diagram p6: Port.SchDoc]

### Parts
B7  1K±25%@100MHz  [0805-B]
C10  22uF ±20% 25V  [C0805]
C11  22uF ±20% 25V  [C0805]
C14  100nF ±10% 50V X7R  [C0402]
C15  100nF ±10% 50V X7R  [C0402]
J1  1.25T-3P-WT  [WAFER_1.25MMX3P_180]
J2  1.25T-6P-WT  [WAFER_1.25MMX6P_180]
J3  NC  [JST_PH 2.00-5]
Q3  AO3401  [SOT23]
R10  0Ω ±1% 100mW  [R0603]
R13  10KΩ ±1% 62.5mW  [R0402]
R28  10KΩ ±1% 62.5mW  [R0402]
T6  VIN  [TP-SIP-1-Small1]
T7  VCC  [TP-SIP-1-Small1]
T14  P+  [TP-SIP-1-Small1]
T15  P-  [TP-SIP-1-Small1]

### Ports
Dev_NC (in, see Top[2B], Control[1C]), EN_Fog (out, see Top[2B], Control[1C]), NebSt (in, see Top[2B], Control[1C]), P+ (in, see Top[2C], Driver[4A]), P- (in, see Top[2C], Driver[4B]), RESET (out, see Top[2B], Control[1B]), SWCLK (out, see Top[2B], Control[1B]), SWDIO (out, see Top[2B], Control[1B])

### Nets
GND: C11.1 C15.1 J2.2 J3.3 R10.1 R28.1
GND_S: C10.1 C14.1 J1.4 J1.5 J2.6 J2.7 J2.8
VCC3V3_SYS: J3.1 R13.2
VCC5V0_SYS: B7.2 C11.2 C15.2 T7.1
Dev_NC: J2.3 ; port Dev_NC
EN_Fog: J2.5 ; port EN_Fog
NebSt: J2.4 ; port NebSt
RESET: J3.5 ; port RESET
SWCLK: J3.2 ; port SWCLK
SWDIO: J3.4 R13.1 ; port SWDIO
NetB1_2: J1.1 T14.1 ; port P+
NetB2_2: J1.2 T15.1 ; port P-
NetB7_1: B7.1 C10.2 C14.2 Q3.3(S) T6.1
NetJ1_3: J1.3 R10.2
NetJ2_1: J2.1 Q3.2(D)
NetQ3_1: Q3.1(G) R28.2

### Notes on the sheet
- Input_Port
- NebSt 雾化器给呼吸机的状态反馈信号，此信号为雾化器反馈当前工作状态的信号
  Dev_NC 呼吸机识别雾化器是否插入的信号，此信号用于呼吸机识别雾化器设备是否连入呼吸机系统
- Driver_Port
- JTAG (Pad)

### Library data of the parts
B7 = Inductor: as B3 on sheet Driver; Published: 8-Jun-2000; LatestRevisionDate: 29-May-2009; LatestRevisionNote: IPC-7351 Footprint Added.; PackageReference: 0402-A; Publisher: Altium Limited; PackageDescription: Chip Inductor; Code_JEITA: 0402
C10 C11 = C0805: CL21A226MAQNNNE; Published: 8-Jun-2000; LatestRevisionDate: 17-Jul-2002; LatestRevisionNote: Re-released for DXP Platform.; PackageReference: RAD-0.3; Publisher: Altium Limited; PackageDescription: Radial Cap, Thru-Hole; 2 Leads; 0.3 in Pin Spacing
C14 C15 = Cap: CL05B104KO5NNNC; Published: 8-Jun-2000; LatestRevisionDate: 17-Jul-2002; LatestRevisionNote: Re-released for DXP Platform.; PackageReference: RAD-0.3; Publisher: Altium Limited; PackageDescription: Radial Cap, Thru-Hole; 2 Leads; 0.3 in Pin Spacing
J1 = Header 5: LatestRevisionDate: 17-Jul-2002; LatestRevisionNote: Re-released for DXP Platform.; Publisher: Altium Limited
J2 = Header 8: LatestRevisionDate: 17-Jul-2002; LatestRevisionNote: Re-released for DXP Platform.; Publisher: Altium Limited
J3 = JST_PH 2.00-5: 品牌：JST 型号：B5B-PH-K-S，直插，间距2.00，5pin; 名称: 插座2针，2.0间距; 制造商: JST; 物料编号: B5B-PH-K-S
Q3 = MOSFET-P: Published: 8-Jun-2000; LatestRevisionDate: 17-Jul-2002; LatestRevisionNote: Re-released for DXP Platform.; PackageVersion: 1995/1996; PackageReference: E3; Publisher: Altium Limited; PackageDescription: TO, Flat Index; 3 In-Line, Axial Leads; Body Dia. 4.6mm; Lead Dia. 0.5 mm (max)
R10 = R0603: 0603WAF0000T5E; Published: 8-Jun-2000; LatestRevisionDate: 17-Jul-2002; LatestRevisionNote: Re-released for DXP Platform.; PackageReference: AXIAL-0.3; Publisher: Altium Limited; PackageDescription: Axial Device, Thru-Hole; 2 Leads; 0.3 in Pin Spacing
R13 R28 = R-0603: 0402WGF1002TCE
T6 T7 T14 T15 = TP-SIP-1-Small

## Nets that join several sheets
GND: Power (10 pins), Control (15 pins), Driver (13 pins), Port (6 pins)
GND_S: Control (R30.1), Port (7 pins)
VCC3V3_SYS: Power (C2.2 U2.5), Control (C5.2 C6.2 R11.2 U4.3), Driver (C19.2 U1.5), Port (J3.1 R13.2)
VCC5V0_SYS: Power (7 pins), Control (ESD2.1 ESD2.2), Indicate (9 pins), Port (B7.2 C11.2 C15.2 T7.1)
VCC15V0_DRV: Power (5 pins), Driver (B3.1 C12.2)
ADC_Current: Control (T2.1 U4.15), Driver (C21.1 R34.2)
ADC_Voltage: Control (T4.1 U4.14), Driver (C18.1 R32.2)
Dev_NC: Control (B4.1 ESD3.2 T10.1), Port (J2.3)
EN_Fog: Control (B6.1 ESD1.2 T12.1), Port (J2.5)
LED_Proc1: Control (U4.9), Indicate (LED1.2)
LED_Proc2: Control (U4.10), Indicate (LED2.2)
LED_Proc3: Control (U4.11), Indicate (LED3.2)
LED_Proc4: Control (U4.12), Indicate (LED4.2)
LED_Proc5: Control (U4.13), Indicate (LED5.2)
NebSt: Control (B5.1 ESD1.1 T11.1), Port (J2.4)
NetB1_2: Driver (B1.2 ES9.2 ES11.1), Port (J1.1 T14.1)
NetB2_2: Driver (B2.2 ES10.1 ES11.2), Port (J1.2 T15.1)
NetLED6_2: Control (U4.27), Indicate (LED6.2)
NetLED7_2: Control (U4.26), Indicate (LED7.2)
NetLED8_2: Control (U4.1), Indicate (LED8.2)
NetLED9_2: Control (U4.22), Indicate (LED9.2)
PWM: Control (T1.1 U4.16), Driver (R16.1)
RESET: Control (C16.2 U4.5), Port (J3.5)
SWCLK: Control (R1.2 U4.21), Port (J3.2)
SWDIO: Control (U4.20), Port (J3.4 R13.1)